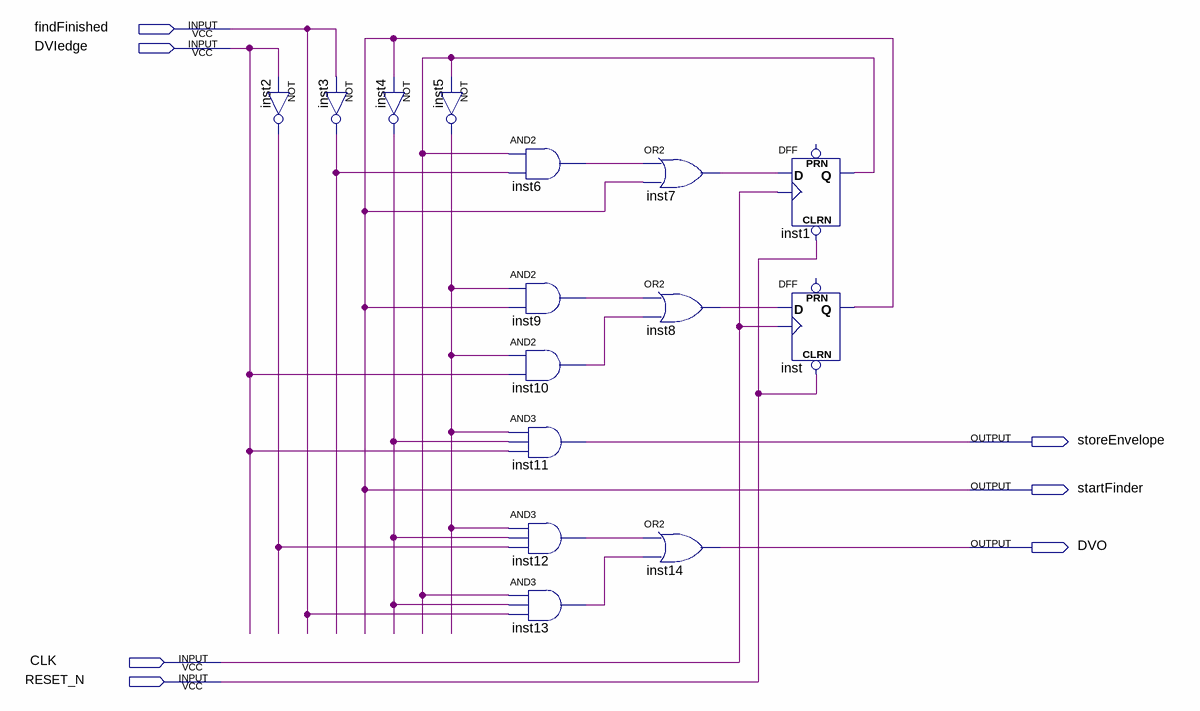
[diagram p0: schematic sheet]
// Quartus schematic filtSTM.bdf as structural Verilog: 15 symbols, 7 pins
module filtSTM (
  input  findFinished,
  input  DVIedge,
  input  CLK,
  input  RESET_N,
  output storeEnvelope,
  output startFinder,
  output DVO
);

  wire inst1_q, inst2_out, inst3_out, inst4_out, inst5_out, inst6_out, inst7_out, inst8_out, inst9_out,
       inst10_out, inst12_out, inst13_out;

  not inst2 (inst2_out, DVIedge);
  not inst3 (inst3_out, findFinished);
  not inst4 (inst4_out, startFinder);
  not inst5 (inst5_out, inst1_q);
  and inst6 (inst6_out, inst1_q, inst3_out);
  and inst9 (inst9_out, inst5_out, startFinder);
  and inst10 (inst10_out, inst5_out, DVIedge);
  and inst11 (storeEnvelope, inst5_out, inst4_out, DVIedge);
  and inst12 (inst12_out, inst5_out, inst4_out, inst2_out);
  and inst13 (inst13_out, inst1_q, inst4_out, findFinished);
  or inst7 (inst7_out, inst6_out, startFinder);
  or inst8 (inst8_out, inst9_out, inst10_out);
  or inst14 (DVO, inst12_out, inst13_out);
  DFF inst1 (.CLRN(RESET_N), .CLK(CLK), .D(inst7_out), .Q(inst1_q));  // open: PRN
  DFF inst (.CLRN(RESET_N), .CLK(CLK), .D(inst8_out), .Q(startFinder));  // open: PRN
endmodule
